# Altium schematic sheet Power.SchDoc
size A4; SheetNumber: 2; SheetTotal: 2; SPICEModelCacheANXLOJPJ: <root> / <DocumentId>ANXLOJPJ</DocumentId> / <CacheFrame Number="0"> / <Model Name="8030_74437356068_6.8u" Kind="CKT"> / <Text>******* / .subckt 8030_74437356068_6.8u  1 2 / Rp 1 2 2112.78616687 / Cp 1 2 20.477571059p / Rs 1 N3 0.0355 / L1 N3 2 6.1u / .ends 8030_74437356068_6.8u</Text> / </Model> / </CacheFrame> / </root>
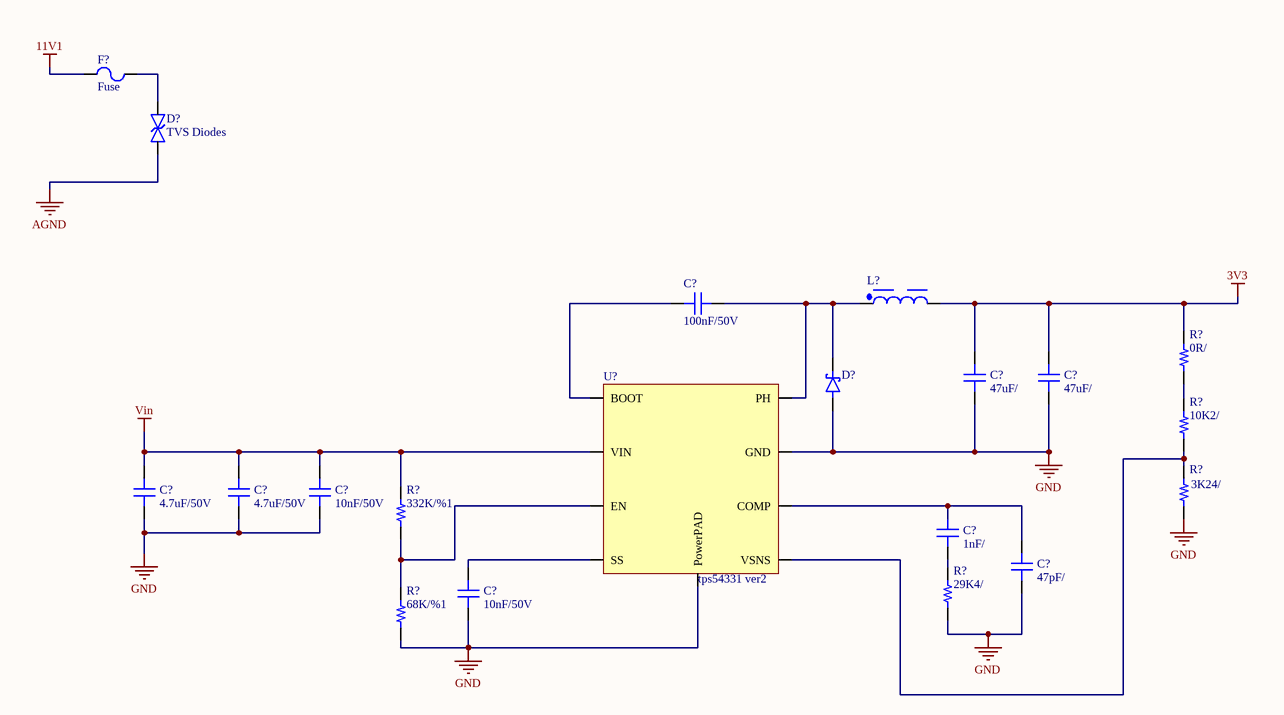
[diagram p0: Power.SchDoc]

## Parts
(Parts that share a designator on the sheet are numbered #1, #2 ... from top to bottom, then left to right.)
C?#1  100nF/50V  [CAP-0805]
C?#2  47uF/  [CAP-1206-0.8MM]
C?#3  47uF/  [CAP-0201]
C?#4  4.7uF/50V  [CAP-0805]
C?#5  4.7uF/50V  [CAP-0805]
C?#6  10nF/50V  [CAP-0805]
C?#7  1nF/  [CAP-0201]
C?#8  47pF/  [CAP-0201]
C?#9  10nF/50V  [CAP-0201]
D?#1  TVS Diodes  [SOT-23-Diode]
D?#2  Schottky Diodes  [DO-214AC]  (value not drawn)
F?  Fuse  [FUSE-0805]
L?  6.8uH, 5.8A  [WE-LHMI_8030]  (value not drawn)
R?#1  0R/  [RES-0201]
R?#2  10K2/  [RES-0805]
R?#3  3K24/  [RES-0805]
R?#4  332K/%1  [RES-0805]
R?#5  29K4/  [RES-0201]
R?#6  68K/%1  [RES-0805]
U?  tps54331 ver2  [SOIC_8]

## Nets
3V3: C?#2.2 C?#3.2 L?.2 R?#1.2
11V1: F?.1
AGND: D?#1.A
GND: C?#2.1 C?#3.1 C?#4.1 C?#5.1 C?#6.1 C?#8.1 C?#9.1 D?#2.A R?#3.1 R?#5.1 R?#6.1 U?.7(GND) U?.9(PowerPAD)
Vin: C?#4.2 C?#5.2 C?#6.2 R?#4.2 U?.2(VIN)
NetC?#1_1: C?#1.1 D?#2.C L?.1 U?.8(PH)
NetC?#1_2: C?#1.2 U?.1(BOOT)
NetC?#7_1: C?#7.1 R?#5.2
NetC?#7_2: C?#7.2 C?#8.2 U?.6(COMP)
NetC?#9_2: C?#9.2 U?.4(SS)
NetD?#1_C: D?#1.C F?.2
NetR?#1_1: R?#1.1 R?#2.2
NetR?#2_1: R?#2.1 R?#3.2 U?.5(VSNS)
NetR?#4_1: R?#4.1 R?#6.2 U?.3(EN)

## Library data of the parts
C?#1 = Ceramic Capacitors-SMD: Voltage: 50V; Capacitance: 100nF
C?#2 C?#3 = Ceramic Capacitors-SMD: Capacitance: 47uF
C?#4 C?#5 = Ceramic Capacitors-SMD: Voltage: 50V; Capacitance: 4.7uF
C?#6 C?#9 = Ceramic Capacitors-SMD: Voltage: 50V; Capacitance: 10nF
C?#7 = Ceramic Capacitors-SMD: Capacitance: 1nF
C?#8 = Ceramic Capacitors-SMD: Capacitance: 47pF
D?#2 = Schottky Diodes: Part Number: B340A-13-F
F? = Fuse: Part Number: MFU0805FF04000P100; Current: *; Voltage: *
L? = 74437356068: WE-LHMI SMT Power Inductor, size 8030, 6.8uH, 5.8A, 49.3mOhm; Manufacturer: Wurth Elektronik; Case/Size Code: 8030; DC Resistance: 35.5mOhm; Saturation Current @ 10%: 6.9A; Saturation Current @ 30%: 14.2A; Self Resonant Frequency: 14MHz; Manufacturer Part Number: 74437356068; Category: Power Inductors; Match Code: WE-LHMI; ComponentLink1Description: Website Link; ComponentLink1URL: https://www.we-online.com/redexpert/article/74437356068?ad; ComponentLink2Description: Datasheet Link; ComponentLink2URL: https://www.we-online.com/redexpert/spec/74437356068?ad; Mount: Surface Mount; Operating Temperature Max: 125°C; Operating Temperature Min: -40°C; Packaging: Tape and Reel; Length: 9.2mm; Width: 8.5mm; Height: 3mm; DC Resistance Max: 49.3mOhm; Inductance: 6.8uH; Performance Rated Current: 5.8A
R?#1 = Chip Resistor - SMD: Value: 0R
R?#2 = Chip Resistor - SMD: Value: 10K2
R?#3 = Chip Resistor - SMD: Value: 3K24
R?#4 = Chip Resistor - SMD: Tolerance: %1; Value: 332K
R?#5 = Chip Resistor - SMD: Value: 29K4
R?#6 = Chip Resistor - SMD: Tolerance: %1; Value: 68K
U? = tps54331 ver2: 3.5V to 28V Input, 3A, 570kHz Step-Down Converter with Eco-mode 8-SOIC -40 to 150